# Altium schematic sheet S02-POWER.SchDoc
size B; SheetNumber: 3; SheetTotal: 5; BLOCK-TITLE: POWER SUPPLY AND ANALOG VOLTAGE REFERENCE; BLOCK-SIZE: B; BLOCK-PROJECT: MULTIMOD AUDIO MODULE; BLOCK-REVISION: 1; BLOCK-ORGANIZATION: UNIVERSITY OF FLORIDA; BLOCK-DESIGNER: MEHRON TALEBI; BLOCK-IDENTIFIER: SUMMER 2023; BLOCK-REVIEWER: MIKE STAPLETON
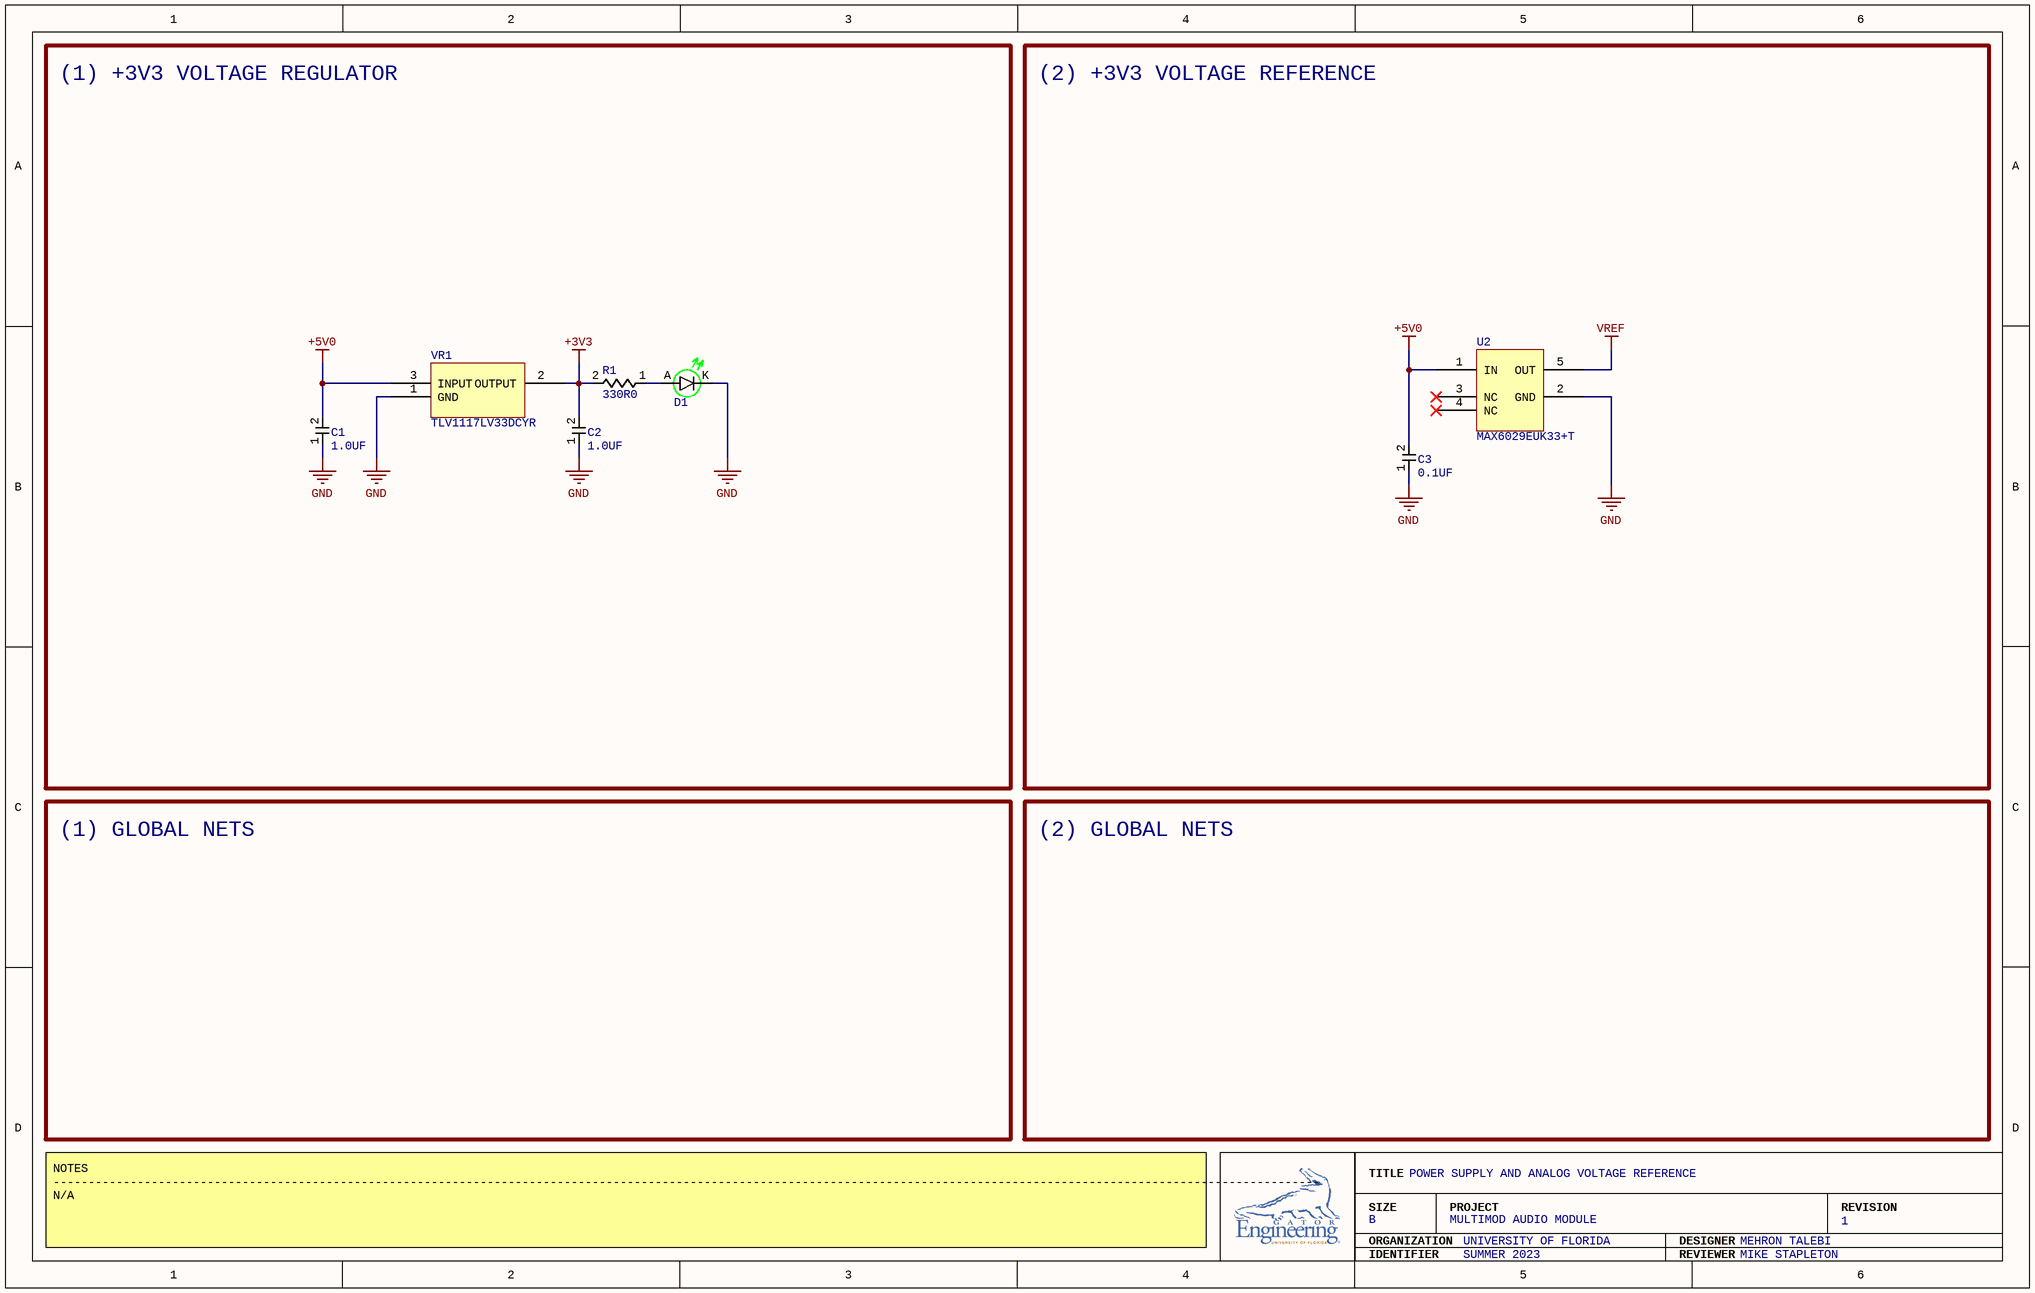
[diagram p0: S02-POWER.SchDoc]

## Parts
C1  1.0UF  [CL21B105KAFNFNE]
C2  1.0UF  [CL21B105KAFNFNE]
C3  0.1UF  [CL21B104KACNNNC]
D1  LTST-C171GKT  [LTST-C171GKT]  (value not drawn)
R1  330R0  [RC0805FR-7W330RL]
U2  MAX6029EUK33+T  [MAX6029EUK33+T]
VR1  TLV1117LV33DCYR  [TLV1117LV33DCYR]

## Blocks framed on the sheet
(1) +3V3 VOLTAGE REGULATOR: C1 C2 D1 R1 VR1
(2) +3V3 VOLTAGE REFERENCE: C3 U2

## Nets
+3V3: C2.2 R1.2 VR1.2(OUTPUT)
+5V0: C1.2 C3.2 U2.1(IN) VR1.3(INPUT)
GND: C1.1 C2.1 C3.1 D1.K U2.2(GND) VR1.1(GND)
VREF: U2.5(OUT)
NetD1_A: D1.A R1.1

Not connected (* = marked no-connect by the designer): U2 3(NC)* 4(NC)*

## Notes on the sheet
- (1) GLOBAL NETS
- (2) GLOBAL NETS
- NOTES
  -------------------------------------------------------------------------------------------------------------------------------------------------------------------------------------
  N/A
- TITLE
- SIZE
- ORGANIZATION
- PROJECT
- DESIGNER
- REVISION
- IDENTIFIER
- REVIEWER

## Library data of the parts
C1 C2 = CL21B105KAFNFNE: CAP CER 1UF 25V X7R 0805; Capacitance: 1 µF; Tolerance: ±10%; Voltage - Rated: 25V; Temperature Coefficient: X7R; Operating Temperature: -55°C ~ 125°C; Applications: General Purpose; Mounting Type: Surface Mount, MLCC; Package / Case: 0805 (2012 Metric); Size / Dimension: 0.079" L x 0.049" W (2.00mm x 1.25mm); Thickness (Max): 0.053" (1.35mm); Supplier 1: Arrow Electronics; Supplier Part Number 1: CL21B105KAFNFNE
C3 = CL21B104KACNNNC: CAP CER 0.1UF 25V X7R 0805; Capacitance: 0.1 µF; Tolerance: ±10%; ComponentLink1Description: Datasheet; ComponentLink1URL: https://media.digikey.com/pdf/Data%20Sheets/Samsung%20PDFs/CL21B105KAFNNNE_Spec.pdf; Voltage - Rated: 25V; Temperature Coefficient: X7R; Operating Temperature: -55°C ~ 125°C; Applications: General Purpose; Mounting Type: Surface Mount, MLCC; Package / Case: 0805 (2012 Metric); Size / Dimension: 0.079" L x 0.049" W (2.00mm x 1.25mm); Thickness (Max): 0.037" (0.95mm); Supplier 1: Arrow Electronics; Supplier Part Number 1: CL21B104KACNNNC
D1 = LTST-C171GKT: LED GREEN CLEAR CHIP SMD; Configuration: Standard; Lens Color: Colorless; Millicandela Rating: 12mcd; Lens Style: Rectangle with Flat Top; Lens Size: 1.40mm x 1.25mm; Voltage - Forward (Vf) (Typ): 2.1V; Current - Test: 20mA; Viewing Angle: 130°; Wavelength - Dominant: 569nm; Wavelength - Peak: 565nm; Color: Green; Lens Transparency: Clear; Mounting Type: Surface Mount; Package / Case: 0805 (2012 Metric); Supplier Device Package: Chip LED; Size / Dimension: 2.00mm L x 1.25mm W; Height (Max): 0.90mm; Supplier 1: Digi-Key; Supplier Part Number 1: 160-1423-1-ND
R1 = RC0805FR-7W330RL: RES 330 OHM 1% 1/4W 0805; Resistance: 330 Ohms; Power (Watts): 0.25W, 1/4W; Temperature Coefficient: ±100ppm/°C; Tolerance: ±1%; Composition: Thick Film; Features: Moisture Resistant; Operating Temperature: -55°C ~ 155°C; Supplier Device Package: 0805; Size / Dimension: 0.079" L x 0.049" W (2.00mm x 1.25mm); Height - Seated (Max): 0.024" (0.60mm); Number of Terminations: 2; Supplier 1: Mouser; Supplier Part Number 1: 603-RC0805FR-7W330RL
U2 = MAX6029EUK33+T: IC VREF SERIES 0.15% SOT23-5; Output Type: Fixed; Voltage - Output (Min/Fixed): 3.3V; Current - Output: 4 mA; Temperature Coefficient: 30ppm/°C; Noise - 0.1Hz to 10Hz: 56µVp-p; Noise - 10Hz to 10kHz: 174µVrms; Voltage - Input: 3.5V ~ 12.6V; Current - Supply: 7.25µA; Reference Type: Series; Tolerance: ±0.15%; Operating Temperature: -40°C ~ 85°C (TA); Mounting Type: Surface Mount; Package / Case: SC-74A, SOT-753; Supplier Device Package: SOT-23-5; Supplier 1: Digi-Key; Supplier Part Number 1: MAX6029EUK33+TCT-ND
VR1 = TLV1117LV33DCYR: IC REG LINEAR 3.3V 1A SOT223-4; Output Configuration: Positive; Output Type: Fixed; Number of Regulators: 1; Voltage - Input (Max): 5.5V; Voltage Dropout (Max): 1.3V @ 800mA; Current - Quiescent (Iq): 100 µA; PSRR: 75dB (120Hz); Protection Features: Over Current, Over Temperature; Voltage - Output (Min/Fixed): 3.3V; Current - Output: 1A; Operating Temperature: -40°C ~ 125°C; Mounting Type: Surface Mount; Package / Case: TO-261-4, TO-261AA; ComponentLink1Description: Datasheet; ComponentLink1URL: https://www.ti.com/lit/ds/symlink/tlv1117lv.pdf; Supplier 1: Digi-Key; Supplier Part Number 1: 296-28778-1-ND